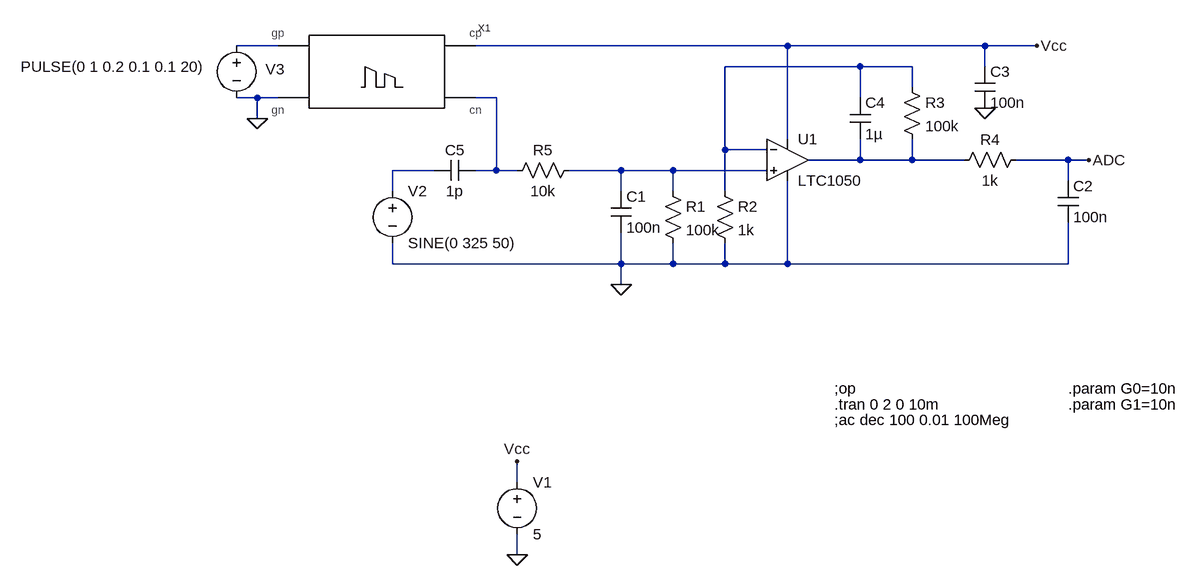
[diagram p0: schematic Ampli.asc]
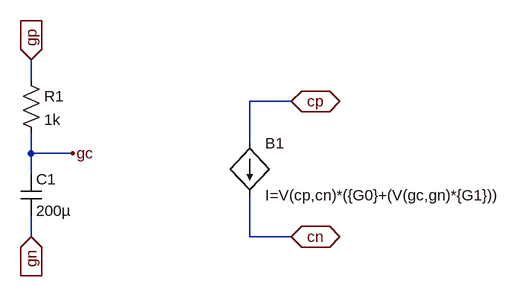
[diagram p1: sub-circuit capteur.asc]
Ampli.asc, the LTspice schematic file:
Version 4
SHEET 1 880 708
WIRE -624 -96 -688 -96
WIRE 160 -96 -320 -96
WIRE 464 -96 160 -96
WIRE 544 -96 464 -96
WIRE 272 -64 64 -64
WIRE 352 -64 272 -64
WIRE 464 -64 464 -96
WIRE 352 -32 352 -64
WIRE -656 -16 -688 -16
WIRE -624 -16 -656 -16
WIRE -288 -16 -320 -16
WIRE 272 -16 272 -64
WIRE -656 16 -656 -16
WIRE 160 48 160 -96
WIRE 64 64 64 -64
WIRE 128 64 64 64
WIRE 272 80 272 48
WIRE 272 80 192 80
WIRE 352 80 352 48
WIRE 352 80 272 80
WIRE 432 80 352 80
WIRE 592 80 512 80
WIRE 624 80 592 80
WIRE -384 96 -448 96
WIRE -288 96 -288 -16
WIRE -288 96 -320 96
WIRE -256 96 -288 96
WIRE -96 96 -176 96
WIRE -16 96 -96 96
WIRE 128 96 -16 96
WIRE 592 112 592 80
WIRE -448 128 -448 96
WIRE -96 128 -96 96
WIRE -16 128 -16 96
WIRE 64 128 64 64
WIRE -448 240 -448 208
WIRE -96 240 -96 192
WIRE -96 240 -448 240
WIRE -16 240 -16 208
WIRE -16 240 -96 240
WIRE 64 240 64 208
WIRE 64 240 -16 240
WIRE 160 240 160 112
WIRE 160 240 64 240
WIRE 592 240 592 176
WIRE 592 240 160 240
WIRE -96 272 -96 240
WIRE -256 576 -256 544
WIRE -256 688 -256 656
FLAG 464 0 0
FLAG -96 272 0
FLAG 544 -96 Vcc
FLAG 624 80 ADC
FLAG -256 688 0
FLAG -256 544 Vcc
FLAG -656 16 0
SYMBOL res -32 112 R0
SYMATTR InstName R1
SYMATTR Value 100k
SYMBOL res 48 112 R0
SYMATTR InstName R2
SYMATTR Value 1k
SYMBOL res 336 -48 R0
SYMATTR InstName R3
SYMATTR Value 100k
SYMBOL res -160 80 R90
WINDOW 0 0 56 VBottom 2
WINDOW 3 32 56 VTop 2
SYMATTR InstName R5
SYMATTR Value 10k
SYMBOL res 528 64 R90
WINDOW 0 0 56 VBottom 2
WINDOW 3 32 56 VTop 2
SYMATTR InstName R4
SYMATTR Value 1k
SYMBOL cap 448 -64 R0
SYMATTR InstName C3
SYMATTR Value 100n
SYMBOL cap 256 -16 R0
SYMATTR InstName C4
SYMATTR Value 1µ
SYMBOL cap 576 112 R0
SYMATTR InstName C2
SYMATTR Value 100n
SYMBOL OpAmps\\LTC1050 160 16 R0
SYMATTR InstName U1
SYMBOL cap -112 128 R0
SYMATTR InstName C1
SYMATTR Value 100n
SYMBOL voltage -256 560 R0
WINDOW 123 24 124 Left 2
WINDOW 39 0 0 Left 0
SYMATTR InstName V1
SYMATTR Value 5
SYMBOL capteur -576 -112 R0
SYMATTR InstName X1
SYMBOL cap -320 80 R90
WINDOW 0 0 32 VBottom 2
WINDOW 3 32 32 VTop 2
SYMATTR InstName C5
SYMATTR Value 1p
SYMBOL voltage -448 112 R0
SYMATTR InstName V2
SYMATTR Value SINE(0 325 50)
SYMBOL voltage -688 -112 R0
WINDOW 0 45 52 Left 2
WINDOW 3 -332 48 Left 2
WINDOW 123 0 0 Left 0
WINDOW 39 0 0 Left 0
SYMATTR InstName V3
SYMATTR Value PULSE(0 1 0.2 0.1 0.1 20)
TEXT 232 456 Left 2 !.tran 0 2 0 10m
TEXT 232 432 Left 2 !;op
TEXT 232 480 Left 2 !;ac dec 100 0.01 100Meg
TEXT 592 432 Left 2 !.param G0=10n
TEXT 592 456 Left 2 !.param G1=10n

capteur.asc, the sub-circuit schematic file:
Version 4
SHEET 1 880 680
WIRE -144 32 -144 0
WIRE 256 64 192 64
WIRE 192 128 192 64
WIRE -144 144 -144 112
WIRE -80 144 -144 144
WIRE -144 176 -144 144
WIRE -144 272 -144 240
WIRE 192 272 192 208
WIRE 256 272 192 272
FLAG 256 64 cp
IOPIN 256 64 BiDir
FLAG 256 272 cn
IOPIN 256 272 BiDir
FLAG -144 0 gp
IOPIN -144 0 In
FLAG -144 272 gn
IOPIN -144 272 In
FLAG -80 144 gc
SYMBOL bi 192 128 R0
SYMATTR InstName B1
SYMATTR Value I=V(cp,cn)*({G0}+(V(gc,gn)*{G1}))
SYMBOL res -160 16 R0
SYMATTR InstName R1
SYMATTR Value 1k
SYMBOL cap -160 176 R0
SYMATTR InstName C1
SYMATTR Value 200µ

The netlist it stands for:
* Ampli.asc
R1 N006 0 100k
R2 N002 0 1k
R3 N002 N004 100k
R5 N006 N003 10k
R4 ADC N004 1k
C3 Vcc 0 100n
C4 N002 N004 1µ
C2 ADC 0 100n
XU1 N006 N002 Vcc 0 N004 LTC1050  ; pins In+ In- V+ V- OUT
C1 N006 0 100n
V1 Vcc 0 5
XX1 N001 0 Vcc N003 capteur
C5 N003 N005 1p
V2 N005 0 SINE(0 325 50)
V3 N001 0 PULSE(0 1 0.2 0.1 0.1 20)

* block symbol definitions
.subckt capteur gp gn cp cn
B1 cp cn I=V(cp,cn)*({G0}+(V(gc,gn)*{G1}))
R1 gp gc 1k
C1 gc gn 200µ
.ends capteur

.tran 0 2 0 10m
;op
;ac dec 100 0.01 100Meg
.param G0=10n
.param G1=10n
.lib LTC.lib
.backanno
.end